# EAGLE design USB-Interface V1.1 (EAGLE 7.6.0)
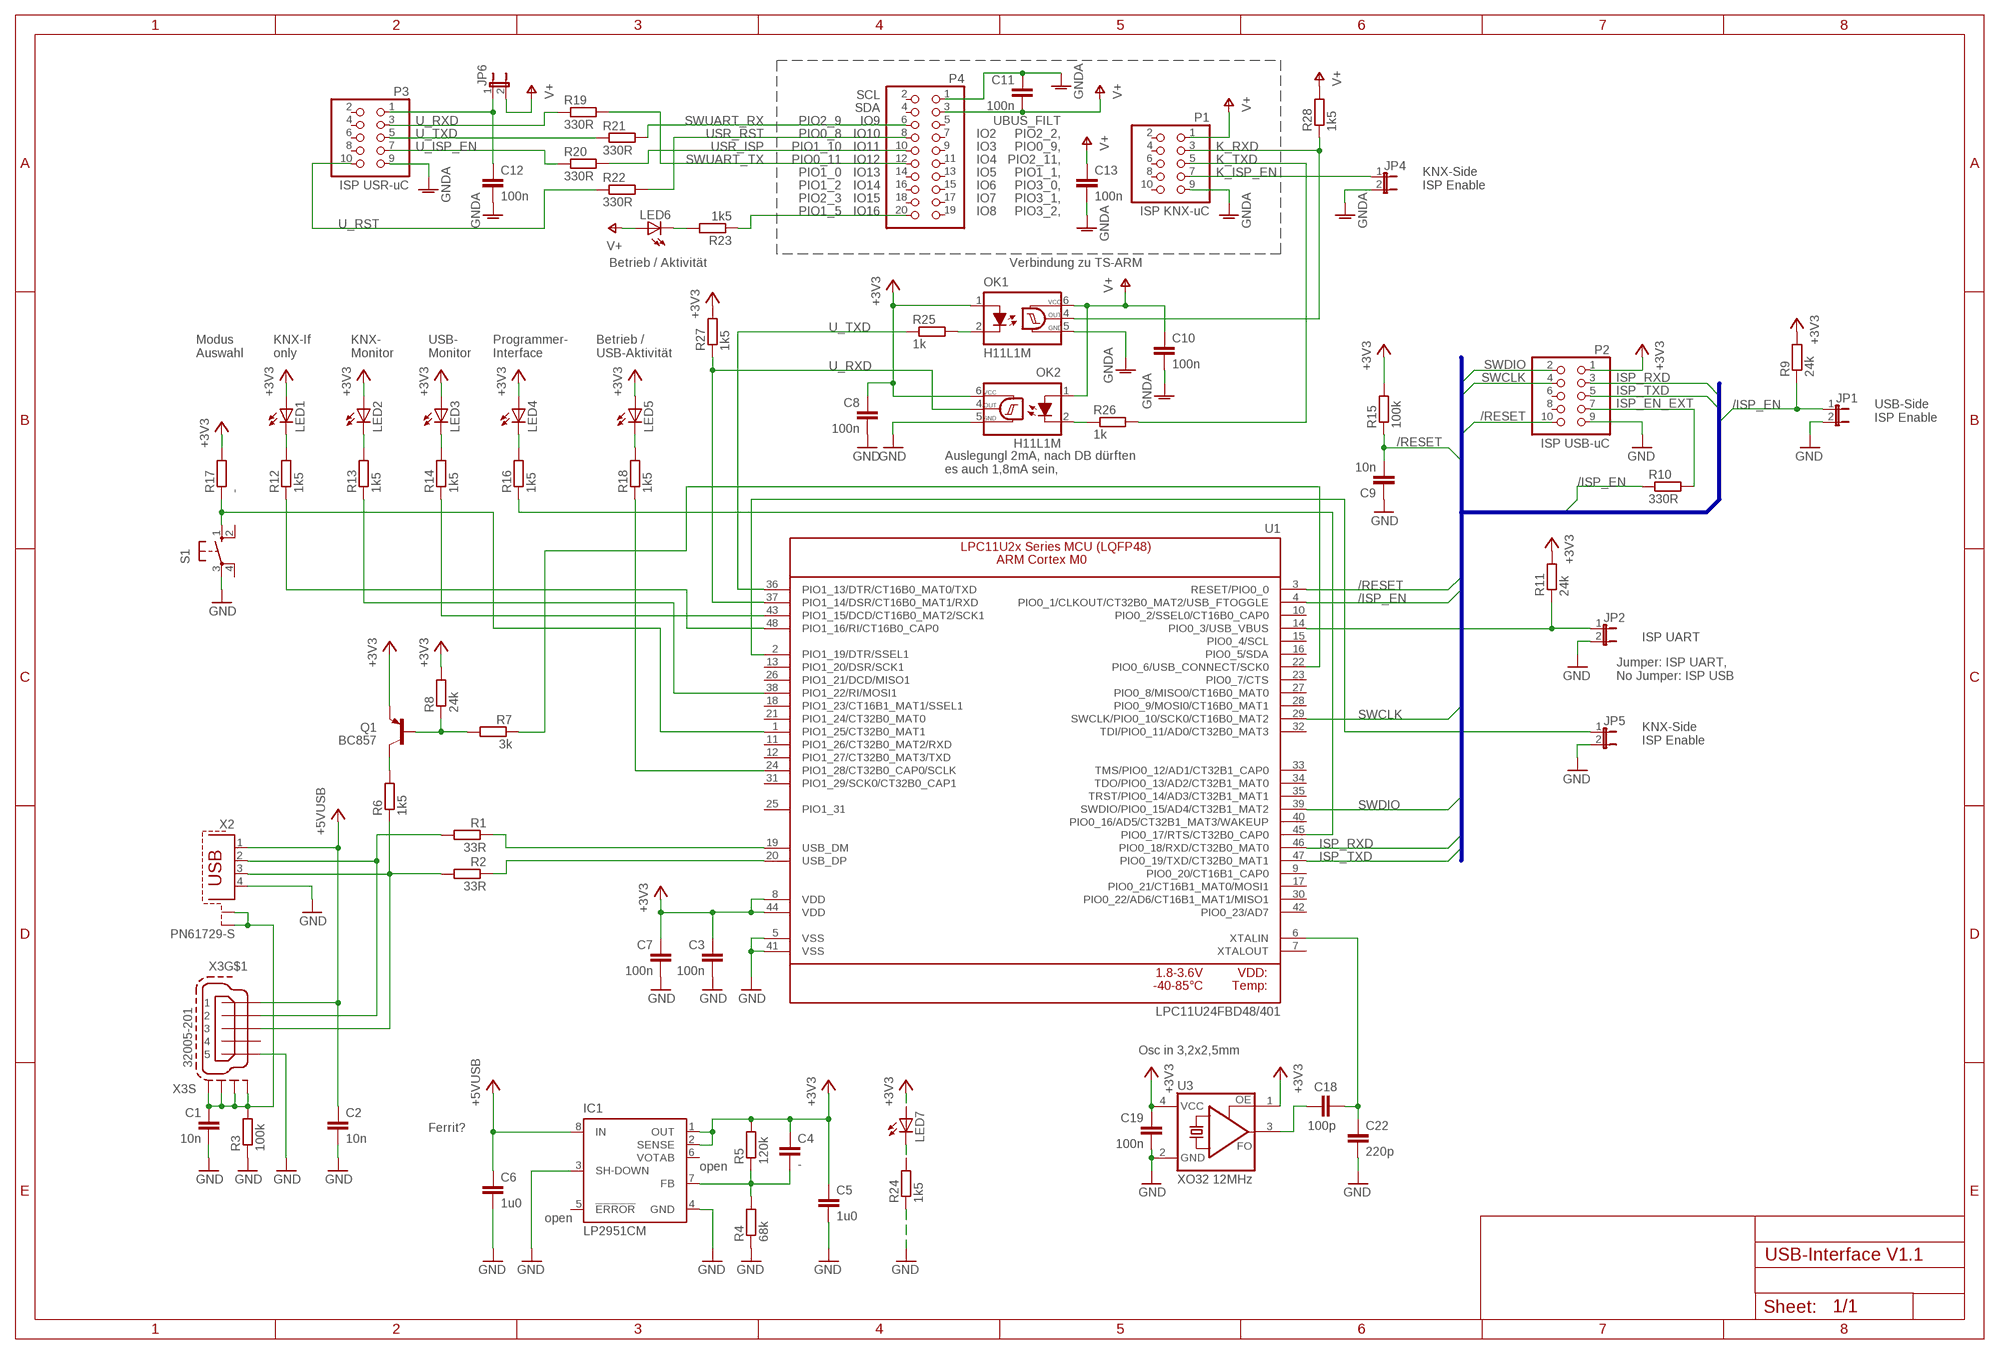
[diagram p0: schematic, sheet 1]

## Parts
C1  10n  C-EUC0805M  [R0805M]
C2  10n  C-EUC0805M  [R0805M]
C3  100n  C-EUC0805M  [R0805M]
C4  -  C-EUC0805M  [R0805M]
C5  1u0  C-EUC0805M  [R0805M]
C6  1u0  C-EUC0805M  [R0805M]
C7  100n  C-EUC0805M  [R0805M]
C8  100n  C-EUC0805M  [R0805M]
C9  10n  C-EUC0805M  [R0805M]
C10  100n  C-EUC0805M  [R0805M]
C11  100n  C-EUC0805M  [R0805M]
C12  100n  C-EUC0805M  [R0805M]
C13  100n  C-EUC0805M  [R0805M]
C18  100p  C-EUC0805M  [R0805M]
C19  100n  C-EUC0805M  [R0805M]
C22  220p  C-EUC0805M  [R0805M]
IC1  LP2951CM  LP2951D  [SO08]
JP1  JP1E  [JP1]
JP2  JP1E  [JP1]
JP4  JP1E  [JP1]
JP5  JP1E  [JP1]
JP6  JP1E  [JP1]
LED1  LEDSMT1206  [1206]
LED2  LEDSMT1206  [1206]
LED3  LEDSMT1206  [1206]
LED4  LEDSMT1206  [1206]
LED5  LEDSMT1206  [1206]
LED6  LEDSMT1206  [1206]
LED7  LEDSMT1206  [1206]
OK1  H11L1M  H11LMM  [DIL06S]
OK2  H11L1M  H11LMM  [DIL06S]
P1  ISP KNX-uC  PINHD-2X05_2.00  [2X05M]
P2  ISP USB-uC  PINHD-2X05_2.00  [2X05M]
P3  ISP USR-uC  PINHD-2X05_2.00  [2X05M]
P4  PINHD-2X10/90  [2X10/90]
Q1  BC857  BC857ASMD  [SOT23-BEC]
R1  33R  R-EU_R0805M  [R0805M]
R2  33R  R-EU_R0805M  [R0805M]
R3  100k  R-EU_R0805M  [R0805M]
R4  68k  R-EU_R0805M  [R0805M]
R5  120k  R-EU_R0805M  [R0805M]
R6  1k5  R-EU_R0805M  [R0805M]
R7  3k  R-EU_R0805M  [R0805M]
R8  24k  R-EU_R0805M  [R0805M]
R9  24k  R-EU_R0805M  [R0805M]
R10  330R  R-EU_R0805M  [R0805M]
R11  24k  R-EU_R0805M  [R0805M]
R12  1k5  R-EU_R0805M  [R0805M]
R13  1k5  R-EU_R0805M  [R0805M]
R14  1k5  R-EU_R0805M  [R0805M]
R15  100k  R-EU_R0805M  [R0805M]
R16  1k5  R-EU_R0805M  [R0805M]
R17  -  R-EU_R0805M  [R0805M]
R18  1k5  R-EU_R0805M  [R0805M]
R19  330R  R-EU_R0805M  [R0805M]
R20  330R  R-EU_R0805M  [R0805M]
R21  330R  R-EU_R0805M  [R0805M]
R22  330R  R-EU_R0805M  [R0805M]
R23  1k5  R-EU_R0805M  [R0805M]
R24  1k5  R-EU_R0805M  [R0805M]
R25  1k  R-EU_R0805M  [R0805M]
R26  1k  R-EU_R0805M  [R0805M]
R27  1k5  R-EU_R0805M  [R0805M]
R28  1k5  R-EU_R0805M  [R0805M]
S1  10-XXSMD  [B3F-10XX_SMD]
U1  LPC11U24FBD48/401  LPC11U24FBD48  [LQFP48]
U3  XO32 12MHz  ASFL  [ASF]
X2  PN61729-S  [PN61729-S]
X3  32005-201  MINI-USB-SCHIELD-32005-201  [32005-201]

## Nets
+3V3: C3.1 C4.1 C5.1 C7.1 C8.1 C19.1 IC1.1(OUT) IC1.2(SENSE) LED1.A LED2.A LED3.A LED4.A LED5.A LED7.A OK1.1(A) OK2.6(VCC) P2.1 Q1.E R5.2 R8.2 R9.2 R11.2 R15.2 R17.2 R27.2 U1.8(VDD) U1.44(VDD) U3.1(OE) U3.4(VCC)
+5V: C2.1 C6.1 IC1.8(IN) X2.1 X3.1 ; supply symbol labelled +5VUSB
/ISP_EN: JP1.1 R9.1 R10.1 U1.4(PIO0_1/CLKOUT/CT32B0_MAT2/USB_FTOGGLE)
/RESET: C9.2 P2.10 R15.1 U1.3(RESET/PIO0_0)
GND: C1.2 C2.2 C3.2 C5.2 C6.2 C7.2 C8.2 C9.1 C19.2 C22.2 IC1.3(SH-DOWN) IC1.4(GND) JP1.2 JP2.2 JP5.2 OK2.5(GND) P2.9 R3.1 R4.1 R24.1 S1.3(P) U1.5(VSS) U1.41(VSS) U3.2(GND) X2.4 X3.5
GNDA: C10.2 C11.1 C12.2 C13.2 JP4.2 OK1.5(GND) P1.9 P3.9 P4.1
ISP_EN1: JP2.1 R11.1 U1.14(PIO0_3/USB_VBUS)
ISP_EN_EXT: P2.7 R10.2
ISP_RXD: P2.3 U1.46(PIO0_18/RXD/CT32B0_MAT0)
ISP_TXD: P2.5 U1.47(PIO0_19/TXD/CT32B0_MAT1)
K_ISP_EN: JP4.1 P1.7
K_RXD: OK1.4(OUT) P1.3 R28.1
K_TXD: P1.5 R26.2
N$1: R1.1 U1.19(USB_DM)
N$2: R2.1 U1.20(USB_DP)
N$3: JP5.1 U1.2(PIO1_19/DTR/SSEL1)
N$4: R1.2 X2.2 X3.2
N$5: R2.2 R6.1 X2.3 X3.3
N$6: C1.1 R3.2 X2.S1 X2.S2 X3.M1(S:S1) X3.M2(S:S2) X3.M3(S:S3) X3.M4(S:S4)
N$7: Q1.B R7.2 R8.1
N$8: C4.2 IC1.7(FB) R4.2 R5.1
N$9: Q1.C R6.2
N$10: R7.1 U1.22(PIO0_6/USB_CONNECT/SCK0)
N$11: LED6.C R23.2
N$12: P4.20 R23.1
N$13: R17.1 S1.1(S) U1.1(PIO1_25/CT32B0_MAT1)
N$14: LED1.C R12.2
N$15: LED2.C R13.2
N$16: C18.1 U3.3(FO)
N$17: LED3.C R14.2
N$18: LED4.C R16.2
N$20: R16.1 U1.45(PIO0_17/RTS/CT32B0_CAP0)
N$21: R14.1 U1.43(PIO1_15/DCD/CT16B0_MAT2/SCK1)
N$22: C18.2 C22.1 U1.6(XTALIN)
N$23: R13.1 U1.38(PIO1_22/RI/MOSI1)
N$24: R12.1 U1.48(PIO1_16/RI/CT16B0_CAP0)
N$25: LED7.C R24.2
N$27: R18.1 U1.24(PIO1_28/CT32B0_CAP0/SCLK)
N$28: LED5.C R18.2
N$29: P3.7 R20.1
N$30: C12.1 JP6.1 P3.1
N$31: OK1.2(C) R25.2
N$32: P3.10 R22.1
N$33: P3.5 R21.1
N$34: P3.3 R19.1
N$35: OK2.2(C) R26.1
SWCLK: P2.4 U1.29(SWCLK/PIO0_10/SCK0/CT16B0_MAT2)
SWDIO: P2.2 U1.39(SWDIO/PIO0_15/AD4/CT32B1_MAT2)
SWUART_RX: P4.6 R21.2
SWUART_TX: P4.12 R19.2
U_RXD: OK2.4(OUT) R27.1 U1.37(PIO1_14/DSR/CT16B0_MAT1/RXD)
U_TXD: R25.1 U1.36(PIO1_13/DTR/CT16B0_MAT0/TXD)
USR_ISP: P4.10 R20.2
USR_RST: P4.8 R22.2
V+: C10.1 C11.2 C13.1 JP6.2 LED6.A OK1.6(VCC) OK2.1(A) P1.1 P4.3 R28.2
Unconnected: IC1.5(!ERROR) IC1.6(VOTAB) P1.2 P1.4 P1.6 P1.8 P1.10 P2.6 P2.8 P3.2 P3.4 P3.6 P3.8 P4.2 P4.4 P4.5 P4.7 P4.9 P4.11 P4.13 P4.14 P4.15 P4.16 P4.17 P4.18 P4.19 S1.2(S1) S1.4(P1) U1.7(XTALOUT) U1.9(PIO0_20/CT16B1_CAP0) U1.10(PIO0_2/SSEL0/CT16B0_CAP0) U1.11(PIO1_26/CT32B0_MAT2/RXD) U1.12(PIO1_27/CT32B0_MAT3/TXD) U1.13(PIO1_20/DSR/SCK1) U1.15(PIO0_4/SCL) U1.16(PIO0_5/SDA) U1.17(PIO0_21/CT16B1_MAT0/MOSI1) U1.18(PIO1_23/CT16B1_MAT1/SSEL1) U1.21(PIO1_24/CT32B0_MAT0) U1.23(PIO0_7/CTS) U1.25(PIO1_31) U1.26(PIO1_21/DCD/MISO1) U1.27(PIO0_8/MISO0/CT16B0_MAT0) U1.28(PIO0_9/MOSI0/CT16B0_MAT1) U1.30(PIO0_22/AD6/CT16B1_MAT1/MISO1) U1.31(PIO1_29/SCK0/CT32B0_CAP1) U1.32(TDI/PIO0_11/AD0/CT32B0_MAT3) U1.33(TMS/PIO0_12/AD1/CT32B1_CAP0) U1.34(TDO/PIO0_13/AD2/CT32B1_MAT0) U1.35(TRST/PIO0_14/AD3/CT32B1_MAT1) U1.40(PIO0_16/AD5/CT32B1_MAT3/WAKEUP) U1.42(PIO0_23/AD7) X3.4

## Buses
SWDIO,SWCLK,ISP_EN,/RESET,/ISP_EN,ISP_RXD,ISP_TXD

## Notes on the sheet
- SCL
- SDA
- U_RXD | PIO2_9 | IO9 | UBUS_FILT
- U_TXD | PIO0_8 | IO10 | IO2 | PIO2_2,
- U_ISP_EN | PIO1_10 | IO11 | IO3 | PIO0_9,
- PIO0_11 | IO12 | IO4 | PIO2_11,
- PIO1_0 | IO13 | IO5 | PIO1_1,
- PIO1_2 | IO14 | IO6 | PIO3_0,
- KNX-Side
  ISP Enable
- PIO2_3 | IO15 | IO7 | PIO3_1,
- PIO1_5 | IO16 | IO8 | PIO3_2,
- U_RST
- Betrieb / Aktivität | Verbindung zu TS-ARM
- Modus
  Auswahl
- KNX-If
  only
- KNX-
  Monitor
- USB-
  Monitor
- Programmer-
  Interface
- Betrieb /
  USB-Aktivität
- USB-Side
  ISP Enable
- Auslegungl 2mA, nach DB dürften
  es auch 1,8mA sein,
- ISP UART
- Jumper: ISP UART,
  No Jumper: ISP USB
- KNX-Side
  ISP Enable
- Osc in 3,2x2,5mm
- Ferrit?
- open
- open

## Library data of the parts
C1-C13 C18 C19 C22 = rcl:C-EU: CAPACITOR, European symbol
IC1 = linear:LP2951: 100 mA, Low Power Low Dropout Voltage Regulator Source: http://www.onsemi.com/pub/Collateral/LP2950-D.PDF
JP1 JP2 JP4-JP6 = jumper:JP1E: JUMPER
LED1-LED7 = led:LED: LED OSRAM: - CHIPLED LG R971, LG N971, LY N971, LG Q971, LY Q971, LO R971, LY R971 LH N974, LH R974 LS Q976, LO Q976, LY Q976 LO Q996 - Hyper CHIPLED LW Q18S LB Q993, LB Q99A, LB R99A - SideLED LS A670, LO A670, LY A670, LG A670, LP A670 LB A673, LV A673, LT A673, LW A673 LH A674 LY A675 LS A676, LA A676, LO A676, LY A676, LW A676 LS A679, LY A679, LG A679 - Hyper Micro SIDELED® LS Y876, LA Y876, LO Y876, LY Y876 LT Y87S - SmartLED LW L88C, LW L88S LB L89C, LB L89S, LG L890 LS L89K, LO L89K, LY L89K LS L896, LA L896, LO L896, LY L896 - TOPLED LS T670, LO T670, LY T670, LG T670, LP T670 LSG T670, LSP T670, LSY T670, LOP T670, LYG T670 LG T671, LOG T671, LSG T671 LB T673, LV T673, LT T673, LW T673 LH T674 LS T676, LA T676, LO T676, LY T676, LB T676, LH T676, LSB T676, LW T676 LB T67C, LV T67C, LT T67C, LS T67K, LO T67K, LY T67K, LW E67C LS E67B, LA E67B, LO E67B, LY E67B, LB E67C, LV E67C, LT E67C LW T67C LS T679, LY T679, LG T679 LS T770, LO T770, LY T770, LG T770, LP T770 LB T773, LV T773, LT T773, LW T773 LH T774 LS E675, LA E675, LY E675, LS T675 LS T776, LA T776, LO T776, LY T776, LB T776 LHGB T686 LT T68C, LB T68C - Hyper Mini TOPLED® LB M676 - Mini TOPLED Santana® LG M470 LS M47K, LO M47K, LY M47K Source: http://www.osram.convergy.de LUXEON: - LUMILED® LXK2-PW12-R00, LXK2-PW12-S00, LXK2-PW14-U00, LXK2-PW14-V00 LXK2-PM12-R00, LXK2-PM12-S00, LXK2-PM14-U00 LXK2-PE12-Q00, LXK2-PE12-R00, LXK2-PE12-S00, LXK2-PE14-T00, LXK2-PE14-U00 LXK2-PB12-K00, LXK2-PB12-L00, LXK2-PB12-M00, LXK2-PB14-N00, LXK2-PB14-P00, LXK2-PB14-Q00 LXK2-PR12-L00, LXK2-PR12-M00, LXK2-PR14-Q00, LXK2-PR14-R00 LXK2-PD12-Q00, LXK2-PD12-R00, LXK2-PD12-S00 LXK2-PH12-R00, LXK2-PH12-S00 LXK2-PL12-P00, LXK2-PL12-Q00, LXK2-PL12-R00 Source: www.luxeon.com KINGBRIGHT: KA-3528ASYC Source: www.kingbright.com
OK1 OK2 = optocoupler:H11L*M: 6-Pin DIP Optocoupler Source: http://www.fairchildsemi.com/ds/H1/H11L2-M.pdf
P1-P3 = pinhead-2:PINHD-2X05: PIN HEADER
P4 = pinhead:PINHD-2X10: PIN HEADER
Q1 = transistor-pnp:BC857*: PNP Transistror
R1-R28 = rcl:R-EU_: RESISTOR, European symbol
S1 = switch-omron:10-XX: OMRON SWITCH
U1 = microbuilder:LPC11U24: LPC11U24 32-bit ARM Cortex-M0 microcontroller 32 kB flash 6 kB SRAM (/301) or 8 kB SRAM (/401) 2 kB EEPROM (/301) or 4 kB EEPROM (/401)
U3 = crystal:ASF*: CRYSTAL CLOCK OSCILLATORS 5.0 Vdc or 3.3 Vdc - LOW PROFILE ULTRA MINIATURE CERAMIC SURFACE MOUNT Source: http://www.abracon.com/Oscillators/asf1-L-L1.pdf
X2 = con-berg:PN61729-S: BERG USB connector; OC_FARNELL: unknown; OC_NEWARK: unknown
X3 = con-cypressindustries:MINI-USB-SCHIELD-: MINI USB-B Conector Source: www.cypressindustries.com; OC_FARNELL: unknown; OC_NEWARK: unknown

## Board
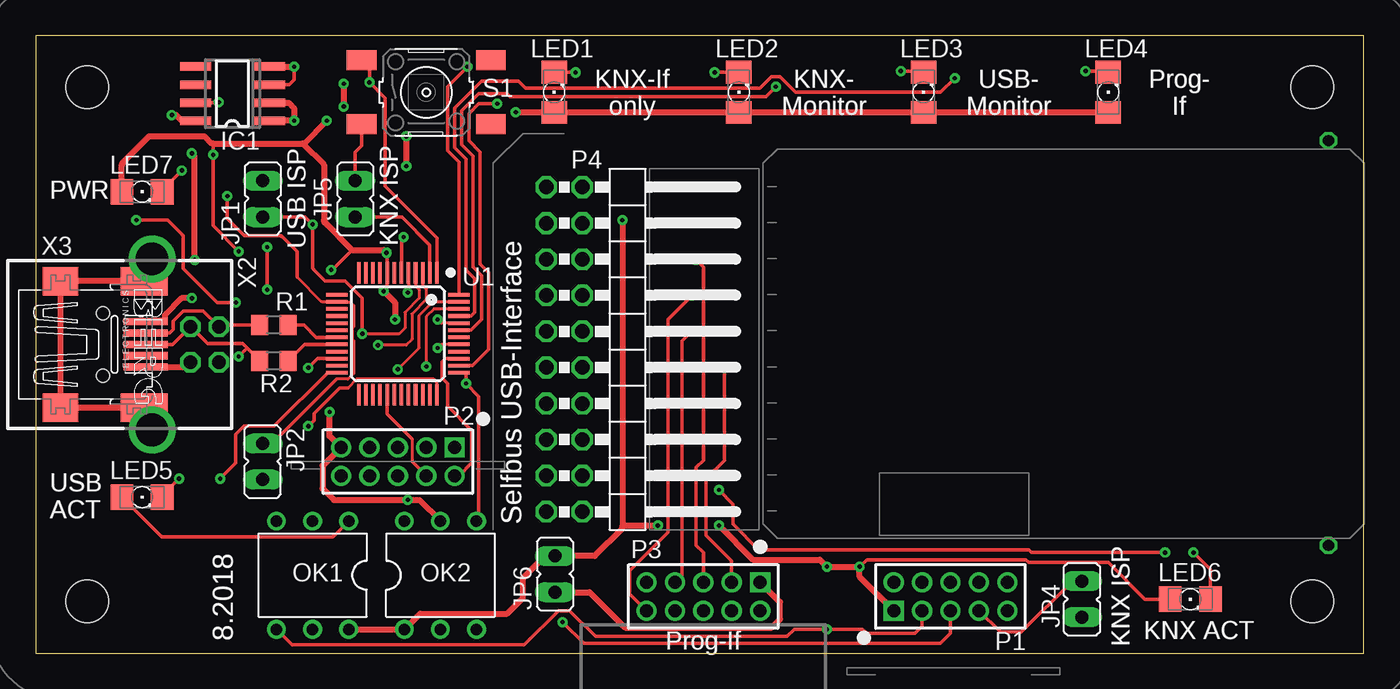
[diagram p1: board, top side]
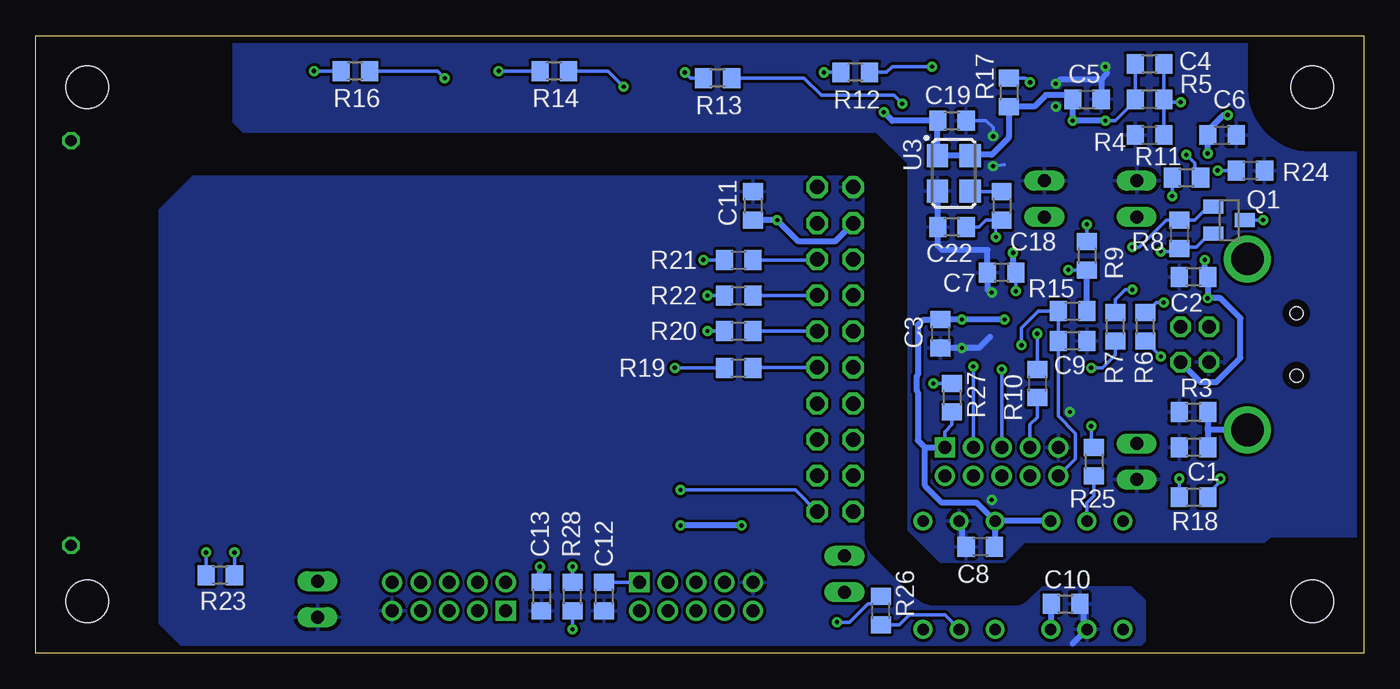
[diagram p2: board, bottom side, seen from below]

Size 93.5 x 43.5 mm. Coordinates in mm from the lower left corner, seen from the top.
Outline: 0,0 93.5,0 93.5,43.5 0,43.5 0,0
Copper layers (1*16): Top 0.035mm / dielectric 1.5mm / Bottom 0.035mm
Design rules "default *": minimum track width 8mil, minimum drill 0.3mm, track to track 8mil, track to pad 8mil, pad to pad 8mil, via to via 8mil, smd to smd 8mil, copper to edge 0.5mm, drill to drill 8mil, minimum pad ring 10mil, minimum via ring 8mil, stop-mask expansion 4mil, vias tented up to drill 0mil, thermal gap 10mil
Holes 3 mm at 89.85,3.65 3.65,39.85 89.85,39.85 3.65,3.65

### Footprints (pad centres in the part's own frame; a part is rotated, then mirrored left to right if it is on the bottom)
R0805M = smd 1.2 x 1.4: 1 -1,0; 2 1,0
SO08 = smd 0.6 x 2.2: 1 -1.905,-2.6; 2 -0.635,-2.6; 3 0.635,-2.6; 4 1.905,-2.6; 5 1.905,2.6; 6 0.635,2.6; 7 -0.635,2.6; 8 -1.905,2.6
JP1 = drill 0.914 long: 1 0,-1.27; 2 0,1.27
1206 = smd 1.6 x 1.803: A -1.422,0; C 1.422,0
DIL06S = drill 0.813: 1 -2.54,-3.81; 2 0,-3.81; 3 2.54,-3.81; 4 2.54,3.81; 5 0,3.81; 6 -2.54,3.81
2X05M = drill 0.914 square: 1 -4,-1 | drill 0.914: 2 -4,1; 3 -2,-1; 4 -2,1; 5 0,-1; 6 0,1; 7 2,-1; 8 2,1; 9 4,-1; 10 4,1
2X10/90 = drill 1.016 octagon: 1 -11.43,-6.35; 2 -11.43,-3.81; 3 -8.89,-6.35; 4 -8.89,-3.81; 5 -6.35,-6.35; 6 -6.35,-3.81; 7 -3.81,-6.35; 8 -3.81,-3.81; 9 -1.27,-6.35; 10 -1.27,-3.81; 11 1.27,-6.35; 12 1.27,-3.81; 13 3.81,-6.35; 14 3.81,-3.81; 15 6.35,-6.35; 16 6.35,-3.81; 17 8.89,-6.35; 18 8.89,-3.81; 19 11.43,-6.35; 20 11.43,-3.81
SOT23-BEC = smd 1 x 1.4: B -0.95,-1.1; C 0,1.1; E 0.95,-1.1
B3F-10XX_SMD = smd 2.1 x 1.4: 1 -4.55,2.25; 2 4.55,2.25; 3 -4.55,-2.25; 4 4.55,-2.25
LQFP48 = smd 1.5 x 0.25: 1 -4.3,2.75; 2 -4.3,2.25; 3 -4.3,1.75; 4 -4.3,1.25; 5 -4.3,0.75; 6 -4.3,0.25; 7 -4.3,-0.25; 8 -4.3,-0.75; 9 -4.3,-1.25; 10 -4.3,-1.75; 11 -4.3,-2.25; 12 -4.3,-2.75; 25 4.3,-2.75; 26 4.3,-2.25; 27 4.3,-1.75; 28 4.3,-1.25; 29 4.3,-0.75; 30 4.3,-0.25; 31 4.3,0.25; 32 4.3,0.75; 33 4.3,1.25; 34 4.3,1.75; 35 4.3,2.25; 36 4.3,2.75 | smd 0.25 x 1.5: 13 -2.75,-4.3; 14 -2.25,-4.3; 15 -1.75,-4.3; 16 -1.25,-4.3; 17 -0.75,-4.3; 18 -0.25,-4.3; 19 0.25,-4.3; 20 0.75,-4.3; 21 1.25,-4.3; 22 1.75,-4.3; 23 2.25,-4.3; 24 2.75,-4.3; 37 2.75,4.3; 38 2.25,4.3; 39 1.75,4.3; 40 1.25,4.3; 41 0.75,4.3; 42 0.25,4.3; 43 -0.25,4.3; 44 -0.75,4.3; 45 -1.25,4.3; 46 -1.75,4.3; 47 -2.25,4.3; 48 -2.75,4.3
ASF = smd 1.6 x 1.5: 1 -1.25,-1.15; 2 1.25,-1.15; 3 1.25,1.15; 4 -1.25,1.15
PN61729-S = drill 0.95 octagon: 1 1.25,4.71; 2 -1.25,4.71; 3 -1.25,2.71; 4 1.25,2.71 | drill 2.3 pad 2.9: S1 -6.02,0; S2 6.02,0
32005-201 = smd 3.1 x 0.5: 1 3,1.6; 2 3,0.8; 3 3,0; 4 3,-0.8; 5 3,-1.6 | smd 2.5 x 2: M1 -3,-4.45; M2 -3,4.45 | smd 3.3 x 2: M3 2.9,4.45; M4 2.9,-4.45 | hole 0.9: 0,2.2; 0,-2.2

### Placement (x,y rotation side)
C1  12,14.5 180 bottom
C2  12,26.5 180 bottom
C3  29.8,22.5 270 bottom
C4  15.1,41.5 0 bottom
C5  19.5,39 0 bottom
C6  10,36.5 0 bottom
C7  25.5,26.8 180 bottom
C8  27,7.5 180 bottom
C9  20.5,22 180 bottom
C10  21,3.5 0 bottom
C11  43,31.5 270 bottom
C12  53.5,4 270 bottom
C13  57.9,4 270 bottom
C18  25.5,31.5 270 bottom
C19  29,37.5 0 bottom
C22  29,30 180 bottom
IC1  13.87,39.4 90 top
JP1  16,32 0 top
JP2  16,13.5 180 top
JP4  73.66,3.81 180 top
JP5  22.5,32 0 top
JP6  36.56,5.58 0 top
LED1  36.5,39.5 90 top
LED2  49.5,39.5 90 top
LED3  62.5,39.5 90 top
LED4  75.5,39.5 90 top
LED5  7.5,11 0 top
LED6  81.28,3.81 0 top
LED7  7.5,32.5 0 top
OK1  19.5,5.5 180 top
OK2  28.5,5.5 0 top
P1  64.4,4 0 top
P2  25.5,13.5 180 top
P3  47,4 180 top
P4  42.3,21.4 270 top
Q1  9.5,30.5 270 bottom
R1  16.78,23.13 180 top
R2  16.78,20.59 180 top
R3  12,17 0 bottom
R4  15.1,36.5 0 bottom
R5  15.1,39 180 bottom
R6  15.4,23 90 bottom
R7  17.5,23 90 bottom
R8  13,29.5 270 bottom
R9  19.5,28 270 bottom
R10  23,19 270 bottom
R11  12.5,33.5 0 bottom
R12  35.8,40.9 180 bottom
R13  45.5,40.5 180 bottom
R14  57,41 180 bottom
R15  20.5,24.1 0 bottom
R16  71,41 180 bottom
R17  25,39.5 270 bottom
R18  12,11 0 bottom
R19  44,20.1 0 bottom
R20  44,22.7 0 bottom
R21  44,27.7 0 bottom
R22  44,25.2 0 bottom
R23  80.5,5.5 180 bottom
R24  8,34 180 bottom
R25  19,13.5 270 bottom
R26  34,3 90 bottom
R27  29,18 270 bottom
R28  55.7,4 90 bottom
S1  27.5,39.5 0 top
U1  25.5,22.5 270 top
U3  28.87,33.8 270 bottom
X2  8.2,21.75 270 top
X3  4.75,21.75 0 top

### Tracks (layer width: path | path; a pad name or v marks a point on that pad's centre or on a via)
+3V3  (via drill 0.3)
  Top 0.203: U1.44 28.55,23.25 v28.3,23.5
  Top 0.254: v24.5,25.5 24.75,25.75 U1.8 24.75,28.18 arc45 v24.7,28.2 | v20.8,27 v20.8,27 arc45 20.97,27.07 22.3,28.4 | 12.5,35.9 v12.5,35.1 12.5,30.1 v14.3,28.3 | LED5.A 8.8,8.27 arc45 8.98,8.2 20.82,8.2 arc45 21,8.27 OK1.1
  Top 0.406: v24.5,25.5 25.3,24.7 v25.3,23.5 | IC1.1 v18.2,37.5 18.2,38.4 17.84,38.77 IC1.2 | LED7.A 6.08,34.37 arc-45 6.15,34.55 8,36.4 11.9,36.4 12.4,35.9 12.5,35.9 18.8,35.9 | LED4.A LED3.A LED2.A LED1.A 36.48,38.1 v33.8,38.1 | v24.7,28.2 24.5,28.4 22.3,28.4 20.37,30.33 arc-45 20.3,30.5 20.3,34.4 18.8,35.9 | 18.8,35.9 18.9,35.9 v20.5,37.5
  Bottom 0.254: v24.5,25.5 C7.1 | C4.1 R5.2 16.1,38.9 17.5,37.5 v18.2,37.5 | Q1.E 10.85,29.55 11.8,28.6 12.9,28.6 R8.2 13,28.6 13.13,28.47 arc45 13.3,28.3 v14.3,28.3 | R9.2 v20.8,27 | R11.2 arc-45 11.57,33.67 11.9,34 11.9,34.5 v12.5,35.1 | R27.2 29,16.1 29.5,15.6 P2.1
  Bottom 0.406: 30.9,14.5 31.4,15 31.4,18.4 31.5,18.5 31.5,19.5 31.4,19.6 31.4,23.1 31,23.5 C3.1 v28.3,23.5 v25.3,23.5 | 30.9,14.5 P2.1 | OK2.6 25.96,7.54 C8.1 | OK1.1 OK2.6 | OK2.6 27.25,10.6 29.7,10.6 30.9,11.8 30.9,14.5 | R15.2 R9.2 | v18.2,37.5 v20.5,37.5 C5.1 20.5,39.3 22.4,39.3 23.2,38.5 R17.2 25,36.41 arc45 25.07,36.23 26.2,35.1 27.6,35.1 arc-45 U3.4 U3.1 30.02,37.48 C19.1 33.2,37.5 v33.8,38.1 | v24.7,28.2 24.7,27.11 arc-45 24.63,26.93 C7.1
+5V  (via drill 0.3)
  Top 0.406: v11,25 10.3,25 9.1,23.8 9.1,23.4 7.8,23.4 X3.1 | v11.2,27.7 11.2,35 v11,35.2 | v9.6,37.9 9.9,37.9 10.3,37.5 IC1.8
  Bottom 0.406: X2.1 11.51,19.1 10.4,19.1 8.7,20.8 8.7,23.6 10.1,25 v11,25 C2.1 arc90 11.2,26.7 v11.2,27.7 | v11,35.2 C6.1 11,36.8 9.9,37.9 v9.6,37.9
/ISP_EN  (via drill 0.3)
  Top 0.203: U1.4 26.75,25.85 27,25.6 27,25 26,24 26,22.9 25.6,22.5 v23,22.5
  Top 0.254: v23,22.5 23,25 21.8,26.2 20.4,26.2 19.57,27.03 arc-45 19.5,27.2 v19.5,30.2 18.97,30.73 JP1.1
  Bottom 0.254: R10.1 v23,22.5 | v19.5,30.2 R9.1
/RESET  (via drill 0.3)
  Top 0.203: U1.3 27.25,25.95 27.5,25.7 27.5,24.9 26.5,23.9 26.5,22.1 26.1,21.7 v24.1,21.7
  Bottom 0.254: P2.10 20.3,13.7 20.3,15.5 21.5,16.7 C9.2 R15.1 22.9,24.1 24.1,22.9 v24.1,21.7
GND  (via drill 0.3)
  Top 0.203: U1.5 26.25,25.45 v26.2,25.4 | U1.41 28.55,21.75 v28.3,21.5
  Top 0.254: JP5.2 22.5,35.3 22.95,35.75 S1.3 | IC1.3 17.84,40.03 18.2,40.4 v18.2,41.3
  Top 0.406: OK2.5 27.01,10.8 v26.2,10.8 21,10.8 20.2,11.6 20.2,13.2 P2.9 20.7,15.3 v20.7,17 | X3.5 10.56,20.15 X2.4 | IC1.4 18,41.3 v18.2,41.3 | v26.1,36.4 v26.1,34.3 | v21.7,40.1 v21.7,38.5
  Bottom 0.254: C19.2 26.6,37.5 26.1,37 v26.1,36.4 | v26.1,34.3 25.3,34.4
  Bottom 0.406: v26.2,25.4 26.5,25.6 C7.2 26.5,28.4 29.7,28.4 30,28.7 C22.2 30,32.53 U3.2 | C3.2 v28.3,21.5 27.1,21.5 26.3,22.3 | OK2.5 28.3,9.11 28.3,7.5 C8.2 | v18.2,41.3 18.1,40.8 18.5,40.4 | 18.5,40.4 C5.2 | 18.5,40.4 21.4,40.4 v21.7,40.1
  pour Bottom: 32.1,8.7 29.8,6.4 25.3,6.4 23.9,7.8 7,7.8 6.6,8.2 0,8.2 0,35.3 3.8,35.3 arc90 8.2,39.7 8.2,43.5 79.6,43.5 79.6,37.4 78.9,36.7 34.3,36.7 32.1,34.5
GNDA
  Bottom 0.406: C10.2 19.7,3.5 19.7,1.89 OK1.5 20.49,0.7
  pour Bottom (rank 2): 35.7,33.6 82.4,33.6 84.8,31.2 84.8,2.1 82.8,0.1 16.2,0.1 15.4,0.9 15.4,3.7 16.4,4.7 22.6,4.7 23.5,3.8 arc45 24.7,3.3 30.3,3.3 arc40 32,4.2 34.5,6.7 arc52 35.2,8.4 35.2,33.1
ISP_EN1  (via drill 0.3)
  Top 0.203: 21.2,19.3 22,19.3 22.4,19.7 22.4,22 22.3,22.1 22.3,22.9 22.4,23 22.4,24.5 22.15,24.75 U1.14 20.15,24.75 18.4,26.5 | 16.03,14.8 JP2.1
  Top 0.254: 21.2,19.3 16.7,14.8 16.03,14.8 | v13.5,32.2 13.5,30.6 14.63,29.47 arc45 14.8,29.4 17.2,29.4 arc-45 17.37,29.33 18.4,28.3 18.4,26.5
  Bottom 0.254: v13.5,32.2 R11.1
ISP_EN_EXT
  Bottom 0.254: R10.2 23,16.6 23.5,16.1 P2.7
ISP_RXD  (via drill 0.3)
  Top 0.203: U1.46 28.05,24.25 27.5,23.7 v27.5,20.2
  Bottom 0.254: P2.3 v27.5,20.2
ISP_TXD  (via drill 0.3)
  Top 0.203: U1.47 27.95,24.75 27,23.8 27,21.5 v25.5,20
  Bottom 0.254: P2.5 v25.5,20
K_ISP_EN
  Top 0.254: P1.7 67.9,1.5 69.4,1.5 72.98,5.08 JP4.1
K_RXD  (via drill 0.3)
  Top 0.254: OK1.4 18.07,0.6 34.4,0.6 36.8,3 37.6,3 39.4,1.2 52.9,1.2 53.4,1.7 v55.7,1.7 58.2,1.7 58.5,1.4 61.9,1.4 62.4,1.9 P1.3
  Bottom 0.254: R28.1 v55.7,1.7
K_TXD  (via drill 0.3)
  Top 0.254: v37.1,2.2 38.6,0.7 63.7,0.7 64.4,1.4 P1.5
  Bottom 0.254: v37.1,2.2 36.2,2.2 34.9,3.5 34.7,3.5 34.2,4 R26.2
N$1
  Top 0.254: U1.19 19.75,22.25 18.9,23.1 17.81,23.1 R1.1
N$2
  Top 0.254: U1.20 18.94,21.75 R2.1
N$3
  Top 0.203: 22.53,30.7 JP5.1
  Top 0.254: U1.2 27.75,28.75 25.8,30.7 22.53,30.7
N$4
  Top 0.254: X3.2 9.45,22.55 9.7,22.8 9.7,23.4 10.4,24.1 11.81,24.1 X2.2 13.04,23.13 R1.2
N$5  (via drill 0.3)
  Top 0.254: 14.88,21.48 14.57,21.8 12.11,21.8 X2.3 9.66,21.75 X3.3 | 14.88,21.48 R2.2 | v14.3,20.9 14.88,21.48
  Bottom 0.254: R6.1 v14.3,20.9
N$6
  Top 0.406: X2.S2 7.72,16.21 arc-45 7.65,16.39 X3.M4 X3.M1 1.75,25.95 arc-90 2,26.2 | X2.S1 8.2,26.86 arc-45 8.13,26.68 X3.M3 2,26.2 | 2,26.2 X3.M2
  Bottom 0.406: X2.S2 10.93,15.73 | 10.93,15.73 arc-45 11,15.7 C1.1 | R3.2 11,15.9 arc-45 10.93,15.73
N$7  (via drill 0.3)
  Top 0.254: v16.3,25.6 v16.3,28.6
  Bottom 0.254: Q1.B 10.95,31.45 11.9,30.5 R8.1 13.9,30.5 15.8,28.6 v16.3,28.6 | R7.2 17.5,24.9 16.8,25.6 v16.3,25.6
N$8  (via drill 0.3)
  Top 0.254: IC1.7 12.87,38.77 v12.9,38.8
  Bottom 0.254: C4.2 R5.1 14.1,38.8 | R4.2 14.1,38.8 | v12.9,38.8 14.1,38.8
N$9  (via drill 0.3)
  Top 0.254: v7.1,30.5 9.3,30.5 10.33,29.47 arc-45 10.4,29.3 10.4,27.1 12.8,24.7 v14.1,24.7
  Bottom 0.254: R6.2 arc-45 15.23,24.07 14.6,24.7 v14.1,24.7 | v7.1,30.5 Q1.C
N$10  (via drill 0.3)
  Top 0.254: U1.22 19.85,20.75 v19.2,20.1
  Bottom 0.254: R7.1 17.5,21.11 arc45 17.57,20.93 18.4,20.1 v19.2,20.1
N$11  (via drill 0.3)
  Top 0.254: LED6.C 82.7,5.9 v81.5,7.1
  Bottom 0.254: v81.5,7.1 R23.2
N$12  (via drill 0.3)
  Top 0.254: v48.1,11.5 49.1,10.5 49.1,9.1 50.9,7.3 69.9,7.3 70.1,7.1 v79.5,7.1
  Bottom 0.254: P4.20 40.02,11.5 v48.1,11.5 | v79.5,7.1 R23.1
N$13  (via drill 0.3)
  Top 0.254: U1.1 28.25,29.25 24.6,32.9 24.6,39.1 v23.5,40.2 23.5,41.09 arc45 23.43,41.27 S1.1
  Bottom 0.254: v23.5,40.2 23.73,40.43 arc-45 23.91,40.5 R17.1
N$14  (via drill 0.3)
  Top 0.254: v38,40.9 36.52,40.9 arc-90 LED1.C
  Bottom 0.254: R12.2 v38,40.9
N$15  (via drill 0.3)
  Top 0.254: v47.8,40.9 49.45,40.9 arc45 LED2.C
  Bottom 0.254: R13.2 47.3,40.5 arc45 47.47,40.57 v47.8,40.9
N$16
  Bottom 0.203: 27.67,32.5 U3.3
  Bottom 0.254: C18.1 27.67,32.5
N$17  (via drill 0.3)
  Top 0.254: v60.9,41 62.32,41 arc-45 LED3.C
  Bottom 0.254: R14.2 v60.9,41
N$18  (via drill 0.3)
  Top 0.254: v73.9,41 75.32,41 arc-45 LED4.C
  Bottom 0.254: R16.2 v73.9,41
N$19  (via drill 0.8)
  other vias: 91,36.1
N$20  (via drill 0.3)
  Top 0.254: U1.45 30.65,23.75 30.9,24 30.9,26.4 30.3,27 30.3,31.4 30.3,34.8 29.5,35.6 29.5,38.4 31.4,40.3 34,40.3 34.5,39.8 51,39.8 51.8,40.6 52.4,40.6 53.5,39.5 63.7,39.5 v64.7,40.5
  Bottom 0.254: v64.7,40.5 65.2,41 R16.1
N$21  (via drill 0.3)
  Top 0.254: U1.43 30.65,22.75 31.4,23.5 31.4,26.6 30.8,27.2 30.8,31.4 30.8,35 30,35.8 30,38.2 31.2,39.4 33.2,39.4 33.4,39.2 51.4,39.2 v52.1,39.9
  Bottom 0.254: R14.1 53.2,41 v52.1,39.9
N$22  (via drill 0.3)
  Top 0.254: U1.6 25.75,29.15 v25.9,29.3
  Bottom 0.203: v25.9,29.3 25.9,30.1 C18.2
  Bottom 0.254: C22.1 27.1,30 26.6,30.5 C18.2
N$23  (via drill 0.3)
  Top 0.254: U1.38 30.75,20.25 31.9,21.4 31.9,26.8 31.3,27.4 31.3,31.4 31.3,35.3 30.5,36.1 30.5,38 31.2,38.7 v32.5,38.7
  Bottom 0.254: R13.1 39.4,40.5 38.2,39.3 33.1,39.3 v32.5,38.7
N$24  (via drill 0.3)
  Top 0.254: U1.48 29.8,31.4 29.8,34.6 29,35.4 29,39.9 v30.4,41.3
  Bottom 0.254: R12.1 33.6,40.9 33.2,41.3 v30.4,41.3
N$25  (via drill 0.3)
  Top 0.254: LED7.C 8.92,32.62 v10.3,34
  Bottom 0.254: v10.3,34 R24.2
N$26  (via drill 0.8)
  other vias: 91,7.6
N$27  (via drill 0.3)
  Top 0.203: U1.24 20.55,19.75
  Top 0.254: 20.55,19.75 16.8,16 14.7,16 14.1,15.4 14.1,13.4 13.07,12.37 arc45 v13,12.3
  Bottom 0.254: R18.1 v13,12.3
N$28  (via drill 0.3)
  Top 0.254: LED5.C 8.92,11.02 arc-45 9,11.2 v10.1,12.3
  Bottom 0.254: v10.1,12.3 10.1,12.1 11,11.2 R18.2
N$29  (via drill 0.3)
  Top 0.254: P3.7 45.5,5.5 45.5,22 v46.2,22.7
  Bottom 0.254: v46.2,22.7 R20.1
N$30
  Top 0.406: JP6.1 38.99,4.31 41.5,1.8 51.8,1.8 52.4,2.4 52.4,3.6 P3.1
  Bottom 0.254: C12.1 P3.1
N$31
  Bottom 0.254: R25.2 19,11.1 19.5,10.6 OK1.2
N$32  (via drill 0.3)
  Top 0.254: v46.2,25.2 44.5,23.5 44.5,8.5 41.8,5.8 41.8,4.2 P3.10
  Bottom 0.254: R22.1 v46.2,25.2
N$33  (via drill 0.3)
  Top 0.254: P3.5 47,7.1 46.5,7.6 46.5,13.1 47,13.6 47,27.2 v46.5,27.7
  Bottom 0.254: v46.5,27.7 R21.1
N$34  (via drill 0.3)
  Top 0.254: v48.5,20.1 48.5,13.6 47.2,12.3 47.2,8.3 49,6.5 P3.3
  Bottom 0.254: R19.1 v48.5,20.1
N$35
  Bottom 0.254: OK2.2 29.51,2.7 32,2.7 32.7,2 R26.1
SWCLK
  Top 0.203: 26.5,15.1 26.5,13.5
  Top 0.254: U1.29 24.75,16.85 26.5,15.1 | 26.5,13.5 P2.4
SWDIO
  Top 0.254: U1.39 28.85,20.75 28.6,20.5 28.6,19.4 29,19 29,17.4 30.7,15.7 30.7,13.4 29.8,12.5 P2.2
SWUART_RX
  Bottom 0.254: R21.2 38.54,27.7 P4.6
SWUART_TX
  Bottom 0.254: P4.12 42.97,20.13 R19.2
U_RXD  (via drill 0.3)
  Top 0.254: OK2.4 31.2,9.47 31.2,18.1 v30.3,19 30.3,19.75 U1.37
  Bottom 0.254: R27.1 v30.3,19
U_TXD  (via drill 0.3)
  Top 0.203: U1.36 28.25,19.05 28,19.3 22.6,19.3 22,18.7
  Top 0.254: 22,18.7 21.4,18.7 19.6,16.9 19.6,16.4 v19.2,16
  Bottom 0.203: 19.2,14.7 R25.1
  Bottom 0.254: v19.2,16 19.2,14.7
USR_ISP
  Bottom 0.254: R20.2 38.52,22.7 P4.10
USR_RST
  Bottom 0.254: R22.2 P4.8
V+  (via drill 0.3)
  Top 0.254: LED6.A 78.09,3.81 75.5,6.4 70.7,6.4 69.9,6.4 69.7,6.6 58.5,6.6 v58,6.1
  Top 0.406: v41.3,30.5 41.3,8.95 | 41.3,8.95 41.3,8.8 39.35,6.85 JP6.2 36.51,6.8 35.8,6.8 34.3,5.3 34.3,3.9 33.2,2.8 27.07,2.8 OK2.1 OK1.6 | 41.3,8.95 41.35,9 v43.8,9 | v48.1,9 50.5,6.6 55.2,6.6 v55.7,6.1 v58,6.1 58,5.4 P1.1
  Bottom 0.254: R28.2 v55.7,6.1
  Bottom 0.406: OK1.6 22,1.73 C10.1 | P4.3 37.24,29 39.8,29 v41.3,30.5 C11.2 | v43.8,9 v48.1,9 | C13.1 58,5.1 v58,6.1

### Text on the board
tPlace: KNX-If / only | KNX- / Monitor | USB- / Monitor | Prog- / If | PWR | KNX ISP | USB ISP | USB / ACT | Selfbus USB-Interface | 8.2018 | Prog-If | KNX ACT | KNX ISP
_tsilk: KNX-If / only | KNX- / Monitor | USB- / Monitor | Prog- / If | PWR | KNX ISP | USB ISP | USB / ACT | Selfbus USB-Interface | 8.2018 | Prog-If | KNX ACT | KNX ISP